# EAGLE design VU-Meter (EAGLE 7.3.0)
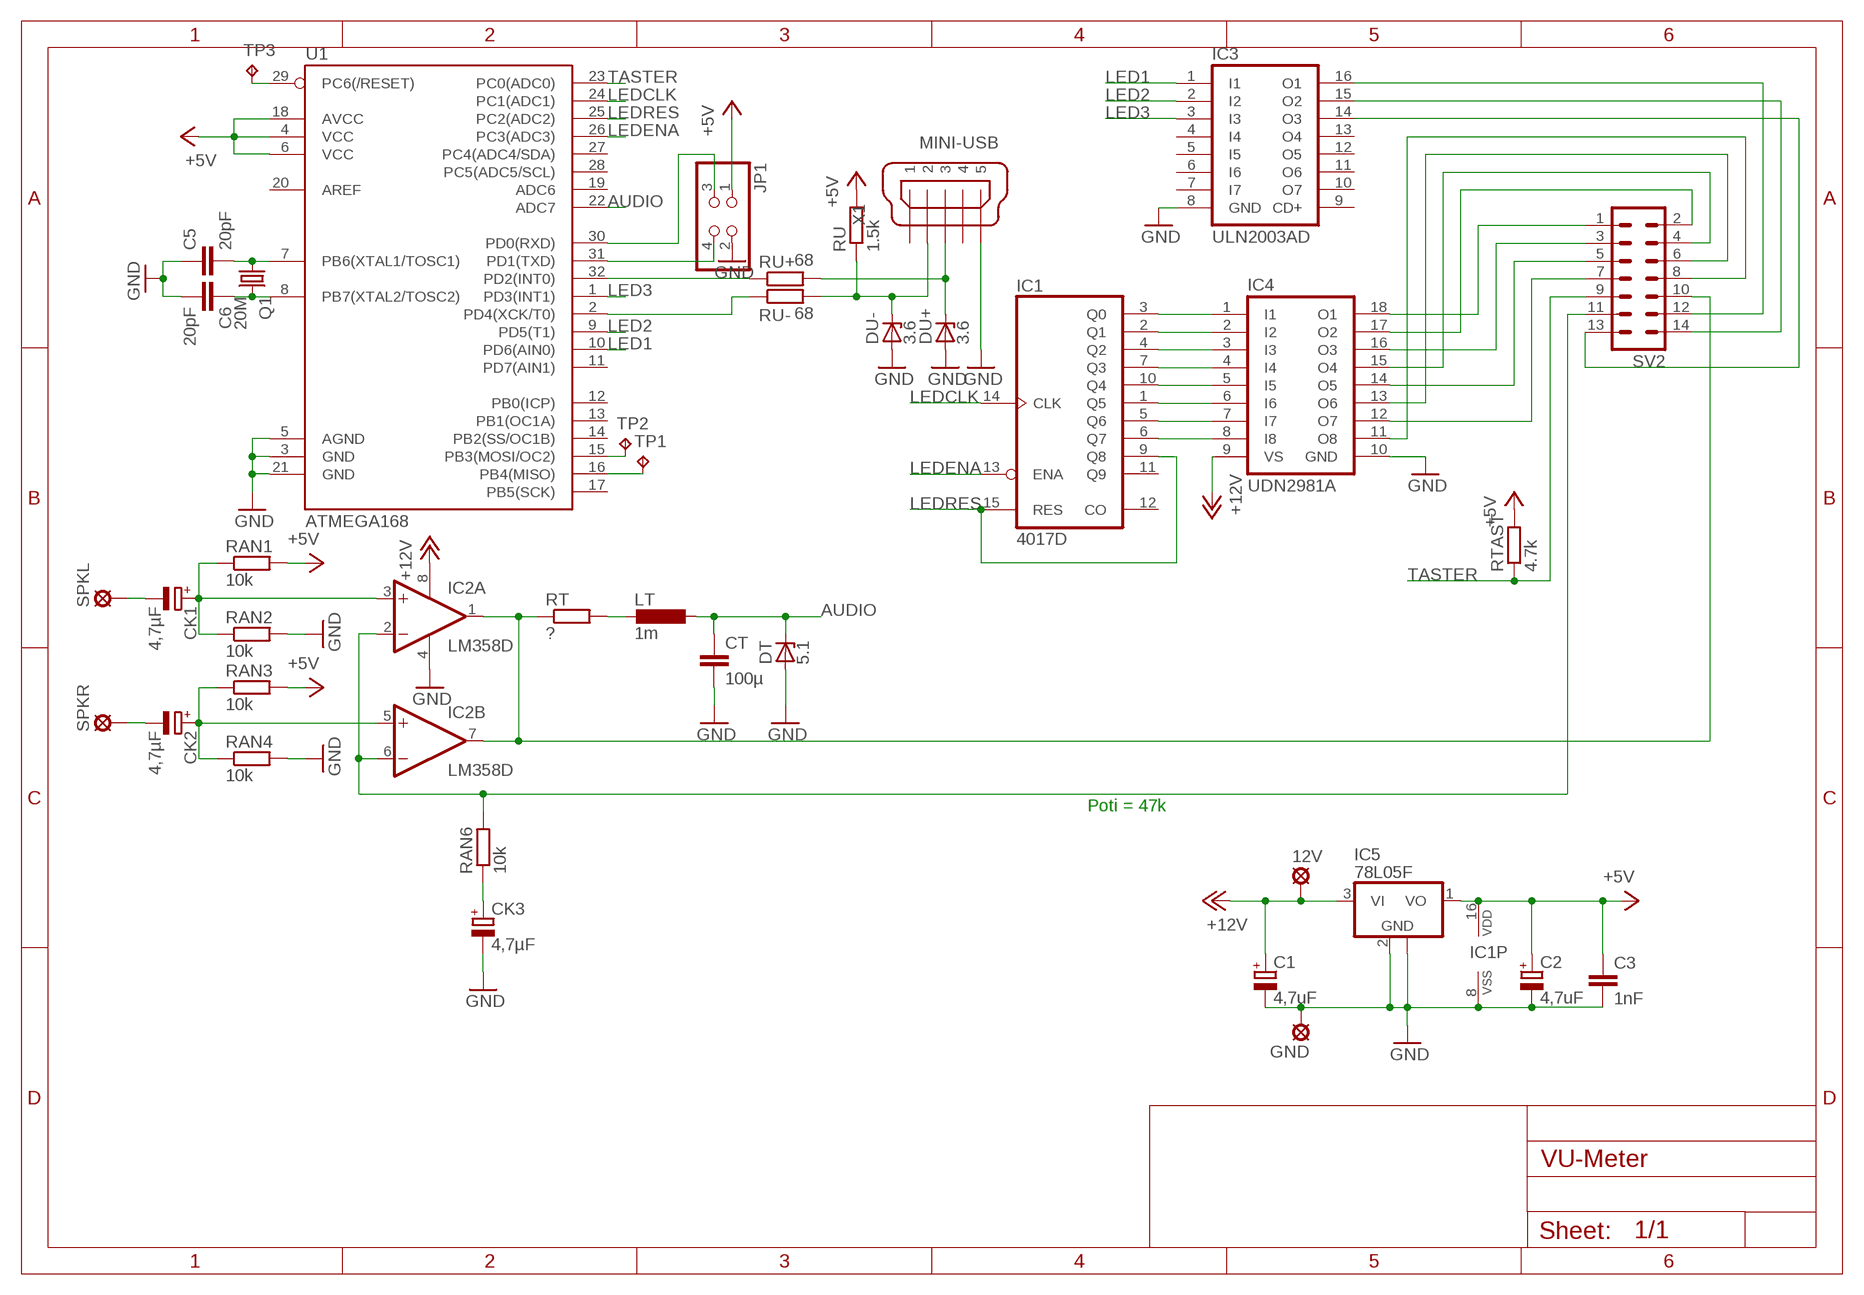
[diagram p0: schematic, sheet 1]

## Parts
12V  LSP13  [LSP13]
C1  4,7uF  CPOL-EU153CLV-0405  [153CLV-0405]
C2  4,7uF  CPOL-EU153CLV-0405  [153CLV-0405]
C3  1nF  C-EUC0805K  [C0805K]
C5  20pF  C-EUC0805K  [C0805K]
C6  20pF  C-EUC0805K  [C0805K]
CK1  4,7µF  CPOL-EU153CLV-0405  [153CLV-0405]
CK2  4,7µF  CPOL-EU153CLV-0405  [153CLV-0405]
CK3  4,7µF  CPOL-EU153CLV-0405  [153CLV-0405]
CT  100µ  C-EUC1210K  [C1210K]
DT  5.1  ZENER-DIODESOD80C  [SOD80C]
DU+  3.6  ZENER-DIODESOD80C  [SOD80C]
DU-  3.6  ZENER-DIODESOD80C  [SOD80C]
GND  LSP13  [LSP13]
IC1  4017D  [SO16]
IC2  LM358D  [SO08]
IC3  ULN2003AD  [SO16]
IC4  UDN2981A  [DIL18]
IC5  78L05F  [SOT89]
JP1  PINHD-2X2/90  [2X02/90]
LT  1m  L-EUPIS2816  [PIS2816]
Q1  20M  CRYSTALSM49  [SM49]
RAN1  10k  R-EU_R0603  [R0603]
RAN2  10k  R-EU_R0603  [R0603]
RAN3  10k  R-EU_R0603  [R0603]
RAN4  10k  R-EU_R0603  [R0603]
RAN6  10k  R-EU_R0603  [R0603]
RT  ?  R-EU_R0603  [R0603]
RTAST  4.7k  R-EU_R0603  [R0603]
RU  1.5k  R-EU_R0603  [R0603]
RU+  68  R-EU_R0603  [R0603]
RU-  68  R-EU_R0603  [R0603]
SPKL  LSP13  [LSP13]
SPKR  LSP13  [LSP13]
SV2  ML14  [ML14]
TP1  TPB1,27  [B1,27]
TP2  TPB1,27  [B1,27]
TP3  TPB1,27  [B1,27]
U1  ATMEGA168  [TQFP32-08]
X1  MINI-USB  MINI-USB_SHIELD5P4-32005-400  [32005-400]

## Nets
+5V: C2.+ C3.1 IC1.16(VDD) IC5.1(VO) JP1.1 RAN1.2 RAN3.2 RTAST.2 RU.2 U1.4(VCC) U1.6(VCC) U1.18(AVCC)
+12V [12V]: 12V.MP C1.+ IC2.8(P:V+) IC4.9(VS) IC5.3(VI)
AUDIO: CT.1 DT.C LT.1 U1.22(ADC7)
GND: C1.- C2.- C3.2 C5.1 C6.2 CK3.- CT.2 DT.A DU+.A DU-.A GND.MP IC1.8(VSS) IC2.4(P:V-) IC3.8(GND) IC4.10(GND) IC5.2(GND) IC5.2@1(GND) JP1.2 RAN2.2 RAN4.2 U1.3(GND) U1.5(AGND) U1.21(GND) X1.5
LED1: IC3.1(I1) U1.10(PD6(AIN0))
LED2: IC3.2(I2) U1.9(PD5(T1))
LED3: IC3.3(I3) U1.1(PD3(INT1))
LEDCLK: IC1.14(CLK) U1.24(PC1(ADC1))
LEDENA: IC1.13(ENA) U1.26(PC3(ADC3))
LEDRES: IC1.9(Q8) IC1.15(RES) U1.25(PC2(ADC2))
N$1: C6.1 Q1.2 U1.8(PB7(XTAL2/TOSC2))
N$2: C5.2 Q1.1 U1.7(PB6(XTAL1/TOSC1))
N$3: TP1.TP U1.16(PB4(MISO))
N$4: IC1.3(Q0) IC4.1(I1)
N$5: IC1.2(Q1) IC4.2(I2)
N$6: IC1.4(Q2) IC4.3(I3)
N$7: IC1.7(Q3) IC4.4(I4)
N$8: IC1.10(Q4) IC4.5(I5)
N$9: IC1.1(Q5) IC4.6(I6)
N$10: IC1.5(Q6) IC4.7(I7)
N$11: IC1.6(Q7) IC4.8(I8)
N$12: TP2.TP U1.15(PB3(MOSI/OC2))
N$13: JP1.3 U1.30(PD0(RXD))
N$14: TP3.TP U1.29(PC6(/RESET))
N$16: LT.2 RT.2
N$17: CK1.+ IC2.3(A:+IN) RAN1.1 RAN2.1
N$19: IC2.1(A:OUT) IC2.7(B:OUT) RT.1 SV2.10
N$25: IC4.18(O1) SV2.1
N$26: IC4.17(O2) SV2.2
N$27: IC4.16(O3) SV2.3
N$28: IC4.15(O4) SV2.4
N$29: IC4.14(O5) SV2.5
N$30: IC4.13(O6) SV2.6
N$31: IC4.12(O7) SV2.7
N$32: IC4.11(O8) SV2.8
N$33: IC3.14(O3) SV2.13
N$34: IC3.15(O2) SV2.14
N$35: IC3.16(O1) SV2.12
N$36: JP1.4 U1.31(PD1(TXD))
N$37: CK2.+ IC2.5(B:+IN) RAN3.1 RAN4.1
N$38: CK1.- SPKL.MP
N$39: CK2.- SPKR.MP
N$40: IC2.2(A:-IN) IC2.6(B:-IN) RAN6.2 SV2.11
N$41: CK3.+ RAN6.1
N$43: RU+.1 U1.32(PD2(INT0))
N$44: RU-.1 U1.2(PD4(XCK/T0))
N$45: DU+.C RU+.2 X1.3
N$46: DU-.C RU-.2 RU.1 X1.2
TASTER: RTAST.1 SV2.9 U1.23(PC0(ADC0))
Unconnected: IC1.11(Q9) IC1.12(CO) IC3.4(I4) IC3.5(I5) IC3.6(I6) IC3.7(I7) IC3.9(CD+) IC3.10(O7) IC3.11(O6) IC3.12(O5) IC3.13(O4) U1.11(PD7(AIN1)) U1.12(PB0(ICP)) U1.13(PB1(OC1A)) U1.14(PB2(SS/OC1B)) U1.17(PB5(SCK)) U1.19(ADC6) U1.20(AREF) U1.27(PC4(ADC4/SDA)) U1.28(PC5(ADC5/SCL)) X1.1 X1.4 X1.M1(S1) X1.M2(S2) X1.M3(S3) X1.M4(S4)

## Notes on the sheet
- Poti = 47k

## Library data of the parts
12V GND SPKL SPKR = solpad:LSP13: SOLDER PAD drill 1.3 mm, distributor Buerklin, 12H562
C1 C2 CK1-CK3 = rcl:CPOL-EU: POLARIZED CAPACITOR, European symbol
C3 = resistor:C-EU: CAPACITOR, European symbol
C5 C6 CT = rcl:C-EU: CAPACITOR, European symbol
DT DU+ DU- = diode:ZENER-DIODE: Z-Diode
IC1 = 40xx:4017: COUNTER/DIVIDER
IC2 = linear:LM358: OP AMP also LM158; LM258; LM2904 Source: http://cache.national.com/ds/LM/LM158.pdf
IC3 = uln-udn:ULN2003A: DRIVER ARRAY
IC4 = uln-udn:UDN298*: DRIVER ARRAY Source: Allegro Microsystems Inc. / UDN2981-UDN2984.pdf
IC5 = linear:78L*: POSITOIV-VOLTAGE REGULATORS Output up to 100 mA Source: Datasheet <http://focus.ti.com/lit/ds/symlink/ua78l05.pdf>
JP1 = pinhead:PINHD-2X2: PIN HEADER
LT = rcl:L-EU: INDUCTOR, European symbol
Q1 = crystal:CRYSTAL: CRYSTAL; OC_FARNELL: unknown; OC_NEWARK: unknown
RAN1-RAN4 RAN6 RT RTAST RU RU+ RU- = resistor:R-EU_: RESISTOR, European symbol
SV2 = con-ml:ML14: HARTING; OC_FARNELL: unknown; OC_NEWARK: unknown
TP1-TP3 = testpad:TP: Test pad
U1 = SparkFun-DigitalIC:ATMEGA168: Atmel 32-pin 8-bit micro, 16k flash.
X1 = con-cypressindustries:MINI-USB_SHIELD5P4-: MINI USB-B R/A W/O POST 5 pol. Source: www.cypressindustries.com; OC_FARNELL: unknown; OC_NEWARK: unknown

## Net classes
0 default: width 0.203 mm
1 12V: width 0.406 mm

## Board
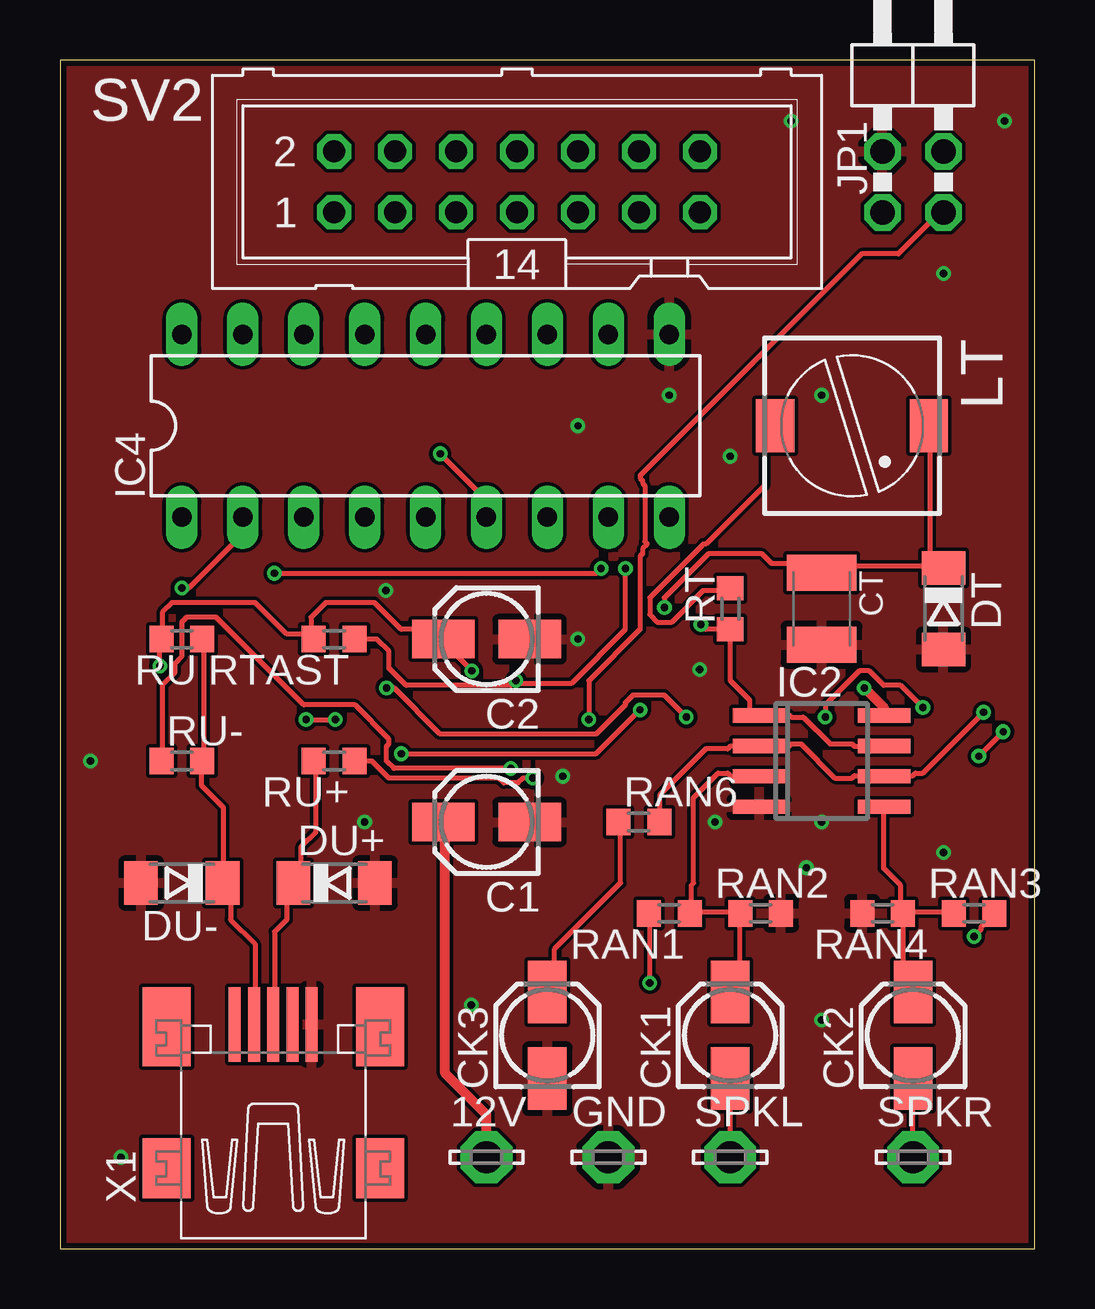
[diagram p1: board, top side]
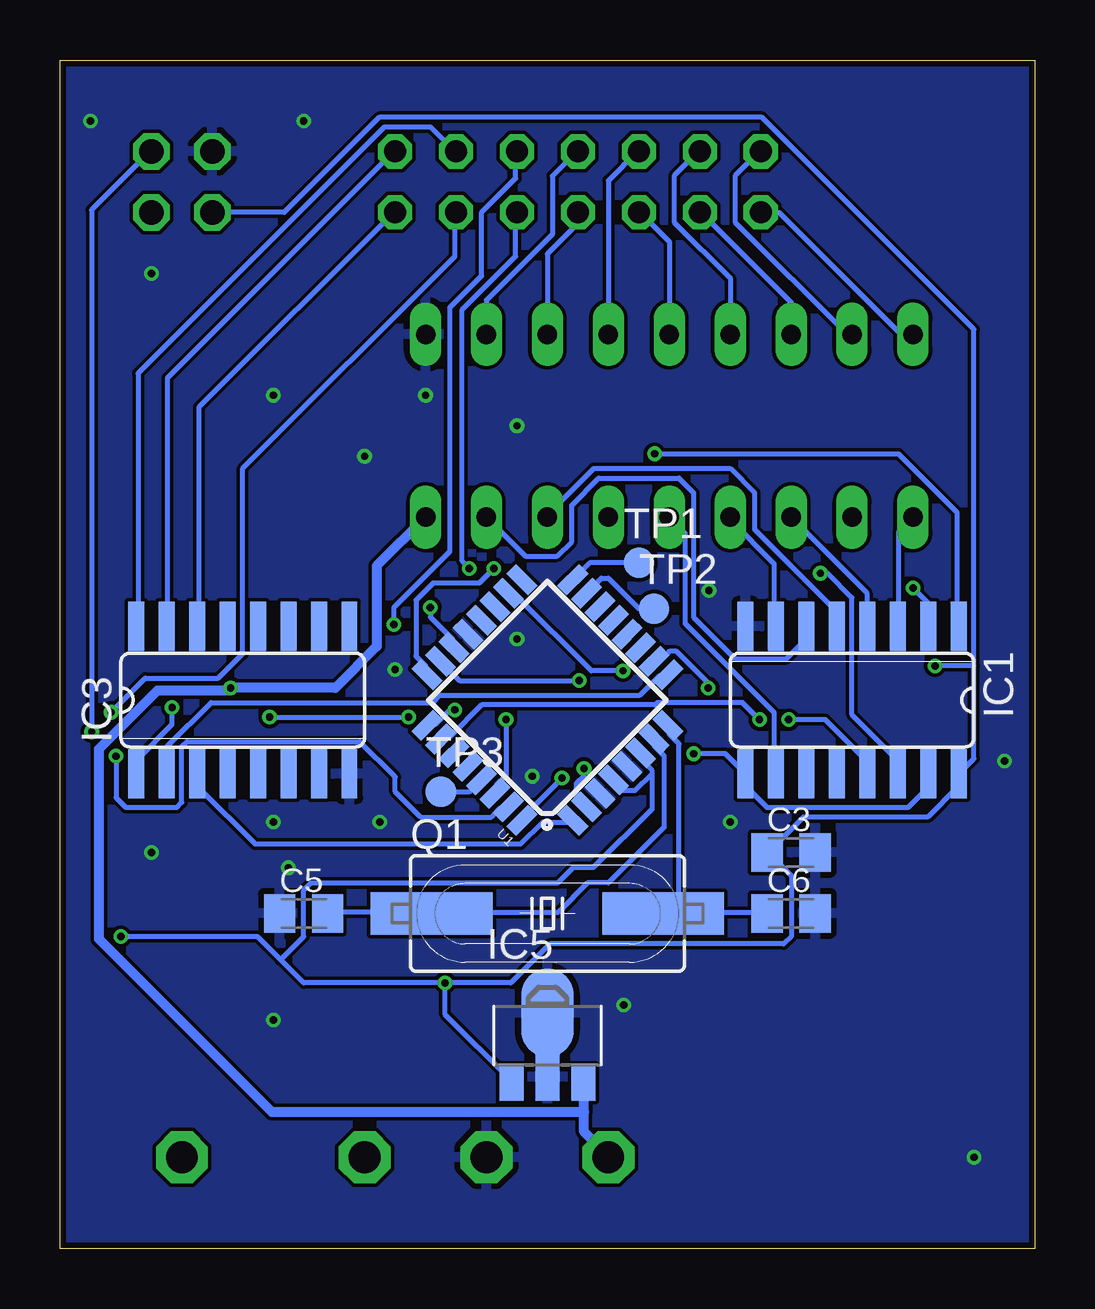
[diagram p2: board, bottom side, seen from below]

Size 40.64 x 49.53 mm. Coordinates in mm from the lower left corner, seen from the top.
Outline: 0,0 40.64,0 40.64,49.53 0,49.53 0,0
Copper layers (1*16): Top 0.035mm / dielectric 1.5mm / Bottom 0.035mm
Design rules "Elecrow_2-layer_eagle_rule": minimum track width 6mil, minimum drill 12mil, track to track 6mil, track to pad 6mil, pad to pad 6mil, via to via 6mil, smd to smd 0mil, copper to edge 10mil, drill to drill 10mil, minimum pad ring 10mil, minimum via ring 6mil, stop-mask expansion 2mil, vias tented up to drill 100mil, thermal gap 10mil

### Footprints (pad centres in the part's own frame; a part is rotated, then mirrored left to right if it is on the bottom)
LSP13 = drill 1.321 pad 2.159 octagon: MP 0,0
153CLV-0405 = smd 2.6 x 1.6: + 1.8,0; - -1.8,0
C0805K = smd 1.3 x 1.6: 1 -1,0; 2 1,0
C1210K = smd 1.5 x 2.9: 1 -1.5,0; 2 1.5,0
SOD80C = smd 1.4 x 1.8: A 1.7,0; C -1.7,0
SO16 = smd 0.66 x 2.032: 1 -4.445,-3.073; 2 -3.175,-3.073; 3 -1.905,-3.073; 4 -0.635,-3.073; 5 0.635,-3.073; 6 1.905,-3.073; 7 3.175,-3.073; 8 4.445,-3.073; 9 4.445,3.073; 10 3.175,3.073; 11 1.905,3.073; 12 0.635,3.073; 13 -0.635,3.073; 14 -1.905,3.073; 15 -3.175,3.073; 16 -4.445,3.073
SO08 = smd 0.6 x 2.2: 1 -1.905,-2.6; 2 -0.635,-2.6; 3 0.635,-2.6; 4 1.905,-2.6; 5 1.905,2.6; 6 0.635,2.6; 7 -0.635,2.6; 8 -1.905,2.6
DIL18 = drill 0.813 long: 1 -10.16,-3.81; 2 -7.62,-3.81; 3 -5.08,-3.81; 4 -2.54,-3.81; 5 0,-3.81; 6 2.54,-3.81; 7 5.08,-3.81; 8 7.62,-3.81; 9 10.16,-3.81; 10 10.16,3.81; 11 7.62,3.81; 12 5.08,3.81; 13 2.54,3.81; 14 0,3.81; 15 -2.54,3.81; 16 -5.08,3.81; 17 -7.62,3.81; 18 -10.16,3.81
SOT89 = smd 1 x 1.5: 1 -1.499,-1.981; 3 1.499,-1.981 | smd 1 x 2: 2 0,-1.727 | smd 2.2 x 3.7: 2@1 0,0.94
2X02/90 = drill 1.016 octagon: 1 -1.27,-6.35; 2 -1.27,-3.81; 3 1.27,-6.35; 4 1.27,-3.81
PIS2816 = smd 2.2 x 1.6: 1 0,3.2; 2 0,-3.2
SM49 = smd 5.08 x 1.778: 1 -4.826,0; 2 4.826,0
R0603 = smd 1 x 1.1: 1 -0.85,0; 2 0.85,0
ML14 = drill 0.914 octagon: 1 -7.62,-1.27; 2 -7.62,1.27; 3 -5.08,-1.27; 4 -5.08,1.27; 5 -2.54,-1.27; 6 -2.54,1.27; 7 0,-1.27; 8 0,1.27; 9 2.54,-1.27; 10 2.54,1.27; 11 5.08,-1.27; 12 5.08,1.27; 13 7.62,-1.27; 14 7.62,1.27
B1,27 = smd 1.27 x 1.27: TP 0,0
TQFP32-08 = smd 1.27 x 0.559: 1 -4.293,2.8; 2 -4.293,2; 3 -4.293,1.2; 4 -4.293,0.4; 5 -4.293,-0.4; 6 -4.293,-1.2; 7 -4.293,-2; 8 -4.293,-2.8; 17 4.293,-2.8; 18 4.293,-2; 19 4.293,-1.2; 20 4.293,-0.4; 21 4.293,0.4; 22 4.293,1.2; 23 4.293,2; 24 4.293,2.8 | smd 0.559 x 1.27: 9 -2.8,-4.293; 10 -2,-4.293; 11 -1.2,-4.293; 12 -0.4,-4.293; 13 0.4,-4.293; 14 1.2,-4.293; 15 2,-4.293; 16 2.8,-4.293; 25 2.8,4.293; 26 2,4.293; 27 1.2,4.293; 28 0.4,4.293; 29 -0.4,4.293; 30 -1.2,4.293; 31 -2,4.293; 32 -2.8,4.293
32005-400 = smd 3.1 x 0.5: 1 3,1.6; 2 3,0.8; 3 3,0; 4 3,-0.8; 5 3,-1.6 | smd 2.5 x 2: M1 -3,-4.45; M2 -3,4.45 | smd 3.3 x 2: M3 2.9,4.45; M4 2.9,-4.45

### Placement (x,y rotation side)
12V  17.78,3.81 0 top
C1  17.78,17.78 180 top
C2  17.78,25.4 180 top
C3  10.16,16.51 0 bottom
C5  30.48,13.97 0 bottom
C6  10.16,13.97 0 bottom
CK1  27.94,8.89 90 top
CK2  35.56,8.89 90 top
CK3  20.32,8.89 90 top
CT  31.75,26.67 270 top
DT  36.83,26.67 270 top
DU+  11.43,15.24 0 top
DU-  5.08,15.24 180 top
GND  22.86,3.81 0 top
IC1  7.62,22.86 180 bottom
IC2  31.75,20.32 270 top
IC3  33.02,22.86 0 bottom
IC4  15.24,34.29 0 top
IC5  20.32,8.89 0 bottom
JP1  35.56,49.53 0 top
LT  33.02,34.29 270 top
Q1  20.32,13.97 0 bottom
RAN1  25.4,13.97 180 top
RAN2  29.21,13.97 0 top
RAN3  38.1,13.97 0 top
RAN4  34.29,13.97 180 top
RAN6  24.13,17.78 0 top
RT  27.94,26.67 90 top
RTAST  11.43,25.4 180 top
RU  5.08,25.4 180 top
RU+  11.43,20.32 180 top
RU-  5.08,20.32 0 top
SPKL  27.94,3.81 0 top
SPKR  35.56,3.81 0 top
SV2  19.05,44.45 0 top
TP1  16.51,28.57 0 bottom
TP2  15.88,26.67 0 bottom
TP3  24.77,19.05 0 bottom
U1  20.32,22.86 135 bottom
X1  8.89,6.35 90 top

### Tracks (layer width: path | path; a pad name or v marks a point on that pad's centre or on a via)
+5V  (via drill 0.3)
  Top 0.203: v24.59,11.07 24.59,13.92 RAN1.2 | v38.1,13.01 38.41,13.31 38.41,13.41 38.91,13.92 RAN3.2 | v17.17,24.08 16.05,25.2 16.05,25.4 C2.+ 15.95,25.4 15.54,25.81 14.22,25.81 13.11,26.92 11.07,26.92 10.46,26.31 10.46,25.6 RTAST.2 10.57,25.4 10.36,25.6 9.45,25.6 8.13,26.92 4.67,26.92 4.27,26.52 4.27,25.4 RU.2 4.17,25.4 v4.17,24.28
  Bottom 0.203: 15.95,19.81 15.95,19.91 16.36,20.32 16.36,20.62 U1.6 | 15.95,19.81 16.66,19.1 17.07,19.1 17.48,19.51 U1.4 17.17,19.1 | v24.59,11.07 24.59,9.75 21.84,7.01 IC5.1 | v38.1,13.01 32.41,13.01 31.45,12.04 | 31.45,12.04 30.48,11.07 v24.59,11.07 | 31.45,12.04 30.48,13.01 30.48,14.94 30.18,15.24 19.89,15.24 19.25,15.88 18.41,15.88 15.95,18.34 15.95,19.81 | v17.17,24.08 18.49,24.08 21.64,27.23 21.84,27.23 U1.18 | JP1.1 31.29,43.18 27.33,47.14 11.38,47.14 2.54,38.3 2.54,24.28 | 2.54,24.28 2.54,20.42 IC1.16 3.25,19.71 3.25,19.2 4.47,17.98 9.65,17.98 11.07,16.56 C3.1 11.07,16.46 10.16,15.54 10.16,13.01 10.46,12.7 20.22,12.7 21.84,11.07 v24.59,11.07 | 2.54,24.28 v4.17,24.28
+12V  (via drill 0.3)
  Top 0.406: v33.53,23.37 34.34,22.55 34.34,22.25 IC2.8 | 12V.MP 17.78,5.59 16.05,7.32 16.05,17.78 C1.+
  Bottom 0.406: IC4.9 27.43,28.45 27.43,25.09 29.16,23.37 v33.53,23.37 33.63,23.27 36.58,23.27 39.01,20.83 39.01,12.9 31.8,5.69 18.8,5.69 | 18.8,5.69 18.8,4.88 17.78,3.86 12V.MP | 18.8,5.69 18.8,6.91 IC5.3
AUDIO  (via drill 0.3)
  Top 0.203: v25.2,26.72 25.2,27.13 27.03,28.96 29.26,28.96 29.67,28.55 31.39,28.55 31.7,28.25 CT.1 31.8,28.25 32,28.45 36.27,28.45 | 36.27,28.45 36.78,28.45 DT.C 36.27,28.45 | 36.27,28.45 36.27,34.24 LT.1
  Bottom 0.203: v25.2,26.72 25.2,26.31 24.28,25.4 24.28,25.09 U1.22
GND  (via drill 0.3)
  other vias: 13.59,27.43 21.59,25.4 20.95,19.68 31.75,17.78 36.83,16.51 31.11,15.88 1.27,20.32 2.54,3.81 21.59,34.29 31.75,35.56 26.67,24.13 12.7,17.78 27.94,33.02 25.4,35.56 27.3,17.78 31.75,9.53 31.75,9.53 17.14,10.16 36.83,40.64 30.48,46.99 39.37,46.99
  pour Bottom: 0,49.53 40.64,49.53 40.64,0 0,0
  pour Top: 0,49.53 40.64,49.53 40.64,0 0,0
LED1  (via drill 0.3)
  Top 0.203: v13.61,23.37 13.92,23.37 15.85,21.44 22.35,21.44 23.57,22.66 23.57,22.76 23.88,23.06 25.2,23.06 v26.11,22.15 | v31.9,22.15 31.9,22.66 33.33,24.08 33.73,24.08 34.34,23.47 35.05,23.47 v35.97,22.55
  Bottom 0.203: v13.61,23.37 13.61,23.57 14.94,24.89 15.24,24.89 15.65,24.49 15.85,24.49 U1.10 | v31.9,22.15 v26.11,22.15 | v35.97,22.55 35.97,21.84 37.39,20.42 37.39,19.81 IC3.1
LED2
  Bottom 0.203: U1.9 15.34,23.88 15.65,23.88 16.46,23.06 24.79,23.06 25.09,22.76 34.34,22.76 36.17,20.93 36.17,19.81 IC3.2
LED3
  Bottom 0.203: U1.1 19.3,17.78 20.52,17.78 21.44,16.87 32.51,16.87 34.85,19.2 34.85,19.71 IC3.3
LEDCLK  (via drill 0.3)
  Top 0.203: v22.55,28.35 22.35,28.14 v8.94,28.14
  Bottom 0.203: v22.55,28.35 23.16,27.74 25.09,27.74 25.81,27.03 25.81,24.69 25.4,24.28 25.4,23.98 U1.24 | v8.94,28.14 8.64,28.14 7.62,27.13 7.62,22.25 5.79,20.42 5.79,19.81 IC1.14
LEDENA  (via drill 0.3)
  Top 0.203: v10.26,22.05 v11.48,22.05
  Bottom 0.203: v11.48,22.05 12.19,22.76 15.75,22.76 15.85,22.66 23.06,22.66 24.38,21.34 24.69,21.34 U1.26 | v10.26,22.05 8.74,22.05 7.01,20.32 7.01,19.81 IC1.13
LEDRES  (via drill 0.3)
  Top 0.203: v24.18,22.45 22.35,20.62 v14.22,20.62
  Bottom 0.203: v24.18,22.45 24.38,22.45 24.99,21.84 25.3,21.84 U1.25 | v14.22,20.62 12.9,20.62 IC1.9 11.99,19.71 11.99,19.2 11.18,18.39 5.28,18.39 4.47,19.2 4.47,19.71 IC1.15
N$1
  Bottom 0.203: U1.8 15.24,21.74 15.24,21.44 14.83,21.03 14.83,14.63 Q1.2 14.83,14.53 14.33,14.02 11.18,14.02 C6.1
N$2
  Bottom 0.203: U1.7 15.85,21.23 15.85,20.93 15.44,20.52 15.44,17.58 17.78,15.24 18.64,15.24 19.86,14.02 25.09,14.02 Q1.1 25.2,14.02 29.46,14.02 C5.2
N$3
  Bottom 0.203: TP1.TP 18.57,28.57 U1.16
N$4
  Bottom 0.203: IC4.1 5.69,29.87 5.69,26.01 IC1.3
N$5  (via drill 0.3)
  Top 0.203: v5.08,27.53 5.38,27.53 7.62,29.77 IC4.2
  Bottom 0.203: v5.08,27.53 4.47,26.92 4.47,26.01 IC1.2
N$6
  Bottom 0.203: IC4.3 7.01,27.33 7.01,26.01 IC1.4
N$7
  Bottom 0.203: IC4.4 12.7,30.38 10.87,28.55 10.87,26.01 IC1.7
N$8
  Bottom 0.203: IC1.10 10.87,19.81 10.87,22.35 14.58,26.06 14.58,29.82 IC4.5
N$9  (via drill 0.3)
  Top 0.203: v15.85,33.12 17.78,31.19 IC4.6
  Bottom 0.203: v15.85,33.12 5.69,33.12 3.25,30.68 3.25,26.01 IC1.1
N$10
  Bottom 0.203: IC4.7 20.32,30.58 18.39,32.51 12.7,32.51 11.68,31.5 11.68,29.97 8.33,26.62 8.33,26.01 IC1.5
N$11
  Bottom 0.203: IC4.8 21.23,28.85 19.91,28.85 19.3,29.46 19.3,30.99 18.19,32.11 14.83,32.11 14.22,31.5 14.22,26.31 12.5,24.59 10.36,24.59 9.55,25.4 9.55,25.91 IC1.6
N$12
  Bottom 0.203: U1.15 18.07,27.94 17.78,27.94 16.51,26.67 TP2.TP
N$13  (via drill 0.3)
  Top 0.203: v22.05,22.05 22.05,23.67 24.18,25.81 24.18,28.85 24.28,28.96 24.28,29.16 24.49,29.36 24.38,29.46 24.38,31.8 24.28,31.9 24.28,32 24.18,32.11 24.18,32.21 33.43,41.45 34.95,41.45 36.68,43.18 JP1.3
  Bottom 0.203: v22.05,22.05 22.05,19.71 22.45,19.3 22.45,19 U1.30
N$14
  Bottom 0.203: TP3.TP 23.56,19.05 U1.29
N$16
  Top 0.203: RT.2 27.94,27.43 26.82,27.43 25.5,26.11 24.89,26.11 24.59,26.42 24.59,27.13 26.82,29.36 26.92,29.36 29.36,31.8 29.36,33.83 29.77,34.24 LT.2
N$17
  Top 0.203: CK1.+ 27.94,10.77 28.35,11.18 28.35,13.92 RAN2.1 28.35,14.02 26.31,14.02 RAN1.1 26.31,14.12 26.31,15.14 26.42,15.24 26.42,18.8 27.43,19.81 27.84,19.81 27.94,19.71 29.06,19.71 IC2.3
N$19  (via drill 0.3)
  Top 0.203: 27.94,25.81 27.94,23.67 28.75,22.86 28.75,22.45 29.06,22.15 IC2.1 29.16,22.25 30.38,22.25 30.48,22.15 30.99,22.15 32.11,21.03 33.02,21.03 33.12,20.93 34.34,20.93 IC2.7 | v26.72,26.01 26.92,25.81 27.94,25.81 | 27.94,25.81 RT.1
  Bottom 0.203: v26.72,26.01 26.72,26.72 24.38,29.06 24.38,39.22 23.06,40.54 23.06,43.18 21.64,44.6 21.64,45.72 SV2.10
N$25
  Bottom 0.203: IC4.18 5.59,38.1 10.67,43.18 SV2.1
N$26
  Bottom 0.203: IC4.17 7.82,38.1 12.5,42.77 12.5,44.7 11.48,45.72 SV2.2
N$27
  Bottom 0.203: IC4.16 10.16,39.42 13.92,43.18 SV2.3
N$28
  Bottom 0.203: IC4.15 12.7,40.44 15.04,42.77 15.04,44.7 14.02,45.72 SV2.4
N$29
  Bottom 0.203: IC4.14 15.24,41.96 16.46,43.18 SV2.5
N$30
  Bottom 0.203: IC4.13 17.78,44.5 16.56,45.72 SV2.6
N$31
  Bottom 0.203: IC4.12 20.32,41.45 19.1,42.67 19.1,43.18 SV2.7
N$32
  Bottom 0.203: IC4.11 22.86,39.52 20.12,42.27 20.12,44.7 19.1,45.72 SV2.8
N$33
  Bottom 0.203: IC3.14 34.85,26.01 34.85,35.05 26.72,43.18 SV2.13
N$34
  Bottom 0.203: IC3.15 36.17,26.01 36.17,36.27 26.72,45.72 SV2.14
N$35
  Bottom 0.203: IC3.16 37.39,26.01 37.39,36.47 27.13,46.74 25.2,46.74 24.18,45.72 SV2.12
N$36  (via drill 0.3)
  Top 0.203: v39.32,21.54 v38.3,20.52
  Bottom 0.203: v38.3,20.52 38.3,18.8 37.9,18.39 35.76,18.39 35.56,18.59 35.56,20.93 35.36,21.13 28.14,21.13 26.67,19.66 26.67,19.05 25.6,17.98 22.66,17.98 22.25,18.39 21.95,18.39 U1.31 | v39.32,21.54 39.32,43.28 36.88,45.72 JP1.4
N$37
  Top 0.203: RAN4.1 35.15,14.02 37.19,14.02 RAN3.1 | RAN4.1 35.15,13.92 35.15,11.18 35.56,10.77 CK2.+ | IC2.5 34.34,18.39 34.34,15.85 35.05,15.14 35.05,14.02 RAN4.1
N$38
  Top 0.203: SPKL.MP CK1.-
N$39
  Top 0.203: SPKR.MP CK2.-
N$40  (via drill 0.3)
  Top 0.203: RAN6.2 24.99,17.78 24.99,18.9 26.92,20.83 27.84,20.83 27.94,20.93 29.06,20.93 IC2.2 29.16,20.93 30.38,20.93 30.48,21.03 30.89,21.03 32.31,19.61 33.02,19.61 33.12,19.71 34.34,19.71 IC2.6 34.44,19.71 35.56,19.71 35.66,19.81 35.97,19.81 v38.51,22.35
  Bottom 0.203: v38.51,22.35 37.08,23.77 34.04,23.77 33.02,24.79 33.02,32.51 24.18,41.35 24.18,43.18 SV2.11
N$41
  Top 0.203: RAN6.1 23.37,17.78 23.37,15.24 20.62,12.5 20.62,11.07 20.32,10.77 CK3.+
N$43  (via drill 0.3)
  Top 0.203: RU+.1 13.01,20.32 13.72,19.61 18.29,19.61 18.49,19.41 19.1,19.41 19.3,19.61 v19.71,19.61
  Bottom 0.203: v19.71,19.61 21.44,17.88 U1.32
N$44  (via drill 0.3)
  Top 0.203: v18.8,20.02 13.92,20.02 13.61,20.32 13.61,20.93 13.72,21.03 13.72,21.23 12.29,22.66 10.16,22.66 6.5,26.31 5.28,26.31 5.08,26.11 5.08,24.69 4.78,24.38 4.78,23.98 4.27,23.47 4.27,20.32 RU-.1
  Bottom 0.203: v18.8,20.02 18.8,19.71 19.1,19.41 19.1,18.8 18.8,18.49 U1.2
N$45
  Top 0.203: RU+.2 10.67,20.32 10.67,17.37 10.06,16.76 10.06,15.54 9.75,15.24 DU+.C 9.65,15.24 9.45,15.04 9.45,13.72 8.94,13.21 8.94,9.45 X1.3
N$46
  Top 0.203: RU.1 5.99,25.4 5.99,20.32 RU-.2 5.89,20.32 5.89,19.3 6.81,18.39 6.81,15.24 | 6.81,15.24 7.11,14.94 7.11,13.72 8.13,12.7 8.13,9.45 X1.2 | 6.81,15.24 DU-.C
TASTER  (via drill 0.3)
  Top 0.203: RTAST.1 13.21,25.4 13.72,24.89 13.72,24.18 14.43,23.47 18.8,23.47 v19,23.67 19,23.57 21.34,23.57 23.57,25.81 v23.57,28.35
  Bottom 0.203: v19,23.67 23.98,23.67 24.69,24.38 U1.23 | v23.57,28.35 23.88,28.65 23.88,39.12 21.64,41.35 21.64,43.18 SV2.9